# EAGLE design LAN_WIZ_V0.1a (EAGLE 6.4)
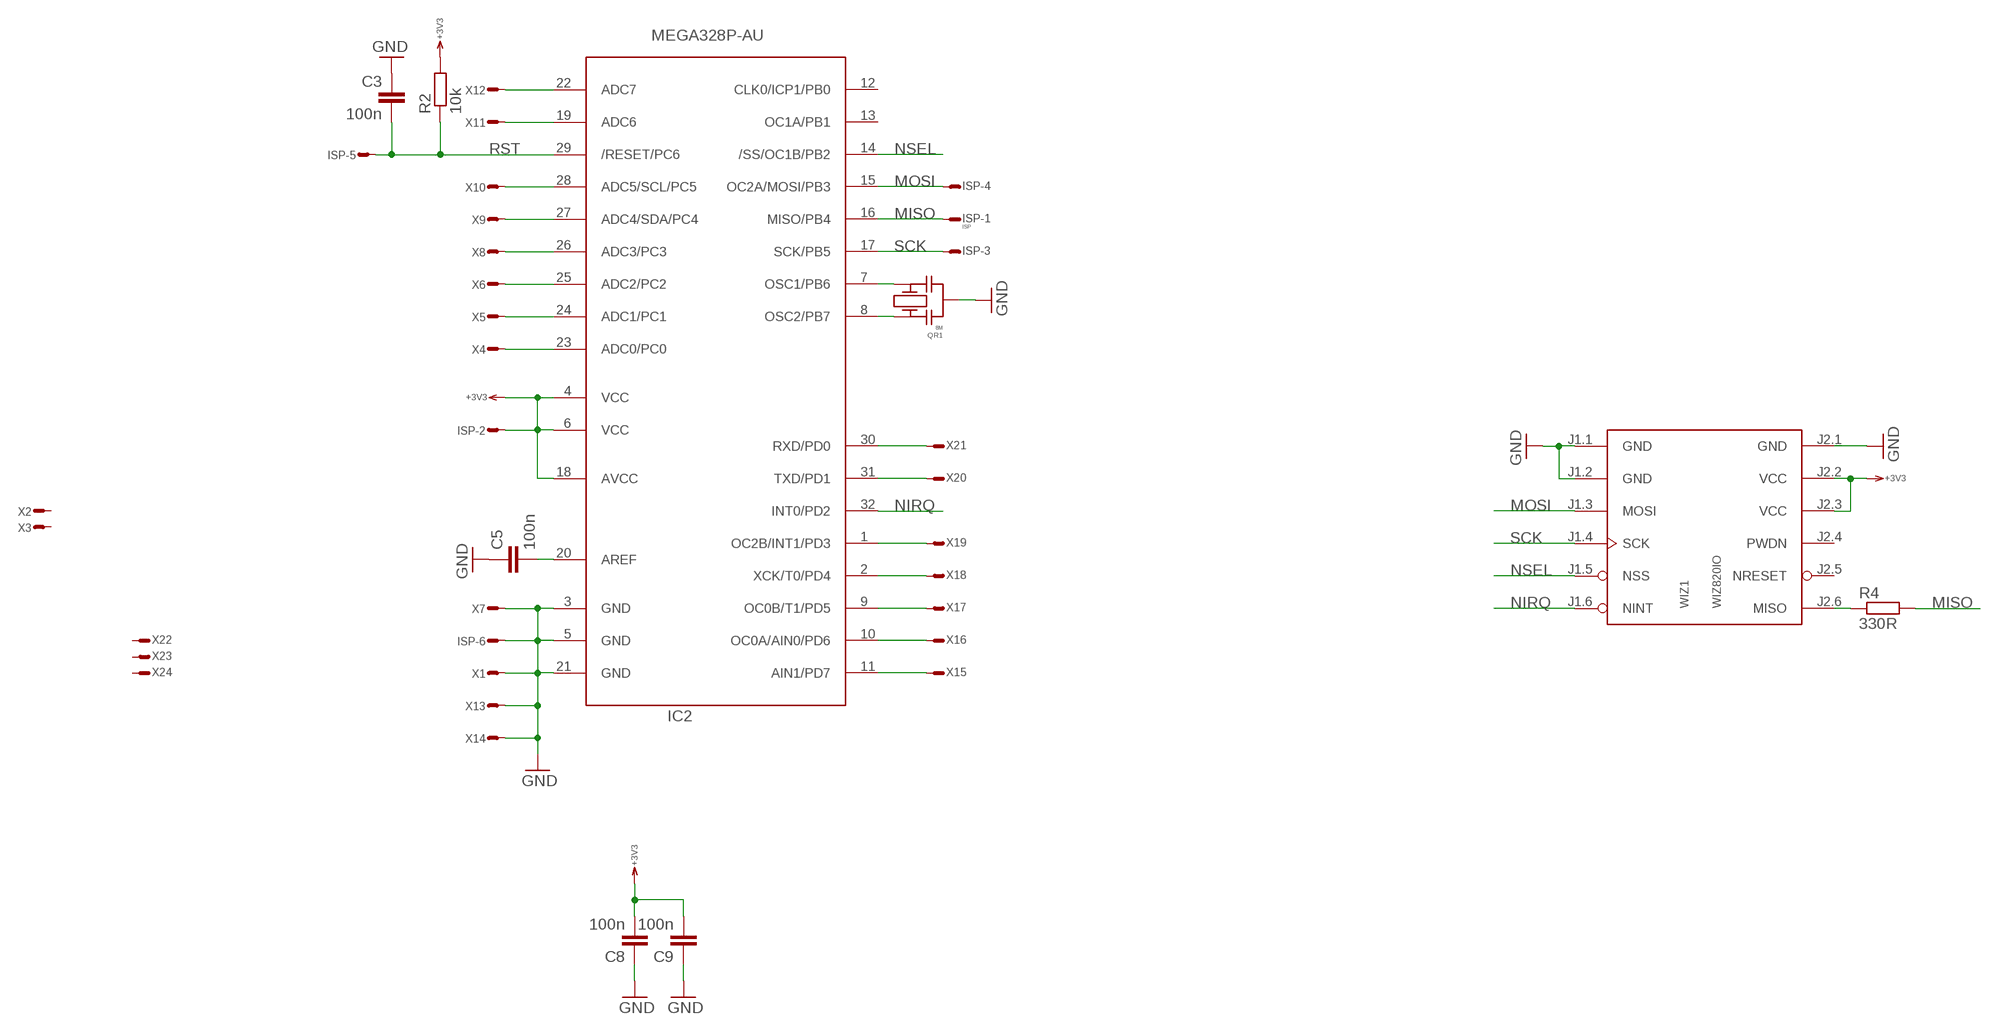
[diagram p0: schematic, sheet 1]

## Parts
C3  100n  C0603  [0603]
C5  100n  C0603  [0603]
C8  100n  C0603  [0603]
C9  100n  C0603  [0603]
IC2  MEGA328P-AU  MEGA168PA  [TQFP32-08]
ISP  ISP  ML6ES  [ML6S]
QR1  8M  QRCR  [CR]
R2  10k  R0603  [0603]
R4  330R  R0603  [0603]
WIZ1  WIZ820IO  [WIZ820IO]
X1  WIREPADT1.6/0.9  [T1.6/0.9]
X2  WIREPADT1.6/0.9  [T1.6/0.9]
X3  WIREPADT1.6/0.9  [T1.6/0.9]
X4  WIREPADT1.6/0.9  [T1.6/0.9]
X5  WIREPADT1.6/0.9  [T1.6/0.9]
X6  WIREPADT1.6/0.9  [T1.6/0.9]
X7  WIREPADT1.6/0.9  [T1.6/0.9]
X8  WIREPADT1.6/0.9  [T1.6/0.9]
X9  WIREPADT1.6/0.9  [T1.6/0.9]
X10  WIREPADT1.6/0.9  [T1.6/0.9]
X11  WIREPADT1.6/0.9  [T1.6/0.9]
X12  WIREPADT1.6/0.9  [T1.6/0.9]
X13  WIREPADT1.6/0.9  [T1.6/0.9]
X14  WIREPADT1.6/0.9  [T1.6/0.9]
X15  WIREPADT1.6/0.9  [T1.6/0.9]
X16  WIREPADT1.6/0.9  [T1.6/0.9]
X17  WIREPADT1.6/0.9  [T1.6/0.9]
X18  WIREPADT1.6/0.9  [T1.6/0.9]
X19  WIREPADT1.6/0.9  [T1.6/0.9]
X20  WIREPADT1.6/0.9  [T1.6/0.9]
X21  WIREPADT1.6/0.9  [T1.6/0.9]
X22  WIREPADT1.6/0.9  [T1.6/0.9]
X23  WIREPADT1.6/0.9  [T1.6/0.9]
X24  WIREPADT1.6/0.9  [T1.6/0.9]

## Nets
+3V3: C8.2 C9.2 IC2.4(VCC) IC2.6(VCC) IC2.18(AVCC) ISP.2 R2.2 WIZ1.J2.2(VCC) WIZ1.J2.3(VCC)
GND: C3.1 C5.1 C8.1 C9.1 IC2.3(GND) IC2.5(GND) IC2.21(GND) ISP.6 QR1.M WIZ1.J1.1(GND) WIZ1.J1.2(GND) WIZ1.J2.1(GND) X1.1(S) X7.1(S) X13.1(S) X14.1(S)
MISO: IC2.16(MISO/PB4) ISP.1 R4.2
MOSI: IC2.15(OC2A/MOSI/PB3) ISP.4 WIZ1.J1.3(MOSI)
N$1: R4.1 WIZ1.J2.6(MISO)
N$2: IC2.23(ADC0/PC0) X4.1(S)
N$3: IC2.24(ADC1/PC1) X5.1(S)
N$4: IC2.25(ADC2/PC2) X6.1(S)
N$5: IC2.26(ADC3/PC3) X8.1(S)
N$6: C5.2 IC2.20(AREF)
N$7: IC2.8(OSC2/PB7) QR1.1
N$8: IC2.7(OSC1/PB6) QR1.2
N$9: IC2.27(ADC4/SDA/PC4) X9.1(S)
N$10: IC2.28(ADC5/SCL/PC5) X10.1(S)
N$12: IC2.19(ADC6) X11.1(S)
N$13: IC2.22(ADC7) X12.1(S)
N$14: IC2.11(AIN1/PD7) X15.1(S)
N$15: IC2.10(OC0A/AIN0/PD6) X16.1(S)
N$16: IC2.9(OC0B/T1/PD5) X17.1(S)
N$17: IC2.2(XCK/T0/PD4) X18.1(S)
N$18: IC2.1(OC2B/INT1/PD3) X19.1(S)
N$19: IC2.31(TXD/PD1) X20.1(S)
N$21: IC2.30(RXD/PD0) X21.1(S)
NIRQ: IC2.32(INT0/PD2) WIZ1.J1.6(NINT)
NSEL: IC2.14(/SS/OC1B/PB2) WIZ1.J1.5(NSS)
RST: C3.2 IC2.29(/RESET/PC6) ISP.5 R2.1
SCK: IC2.17(SCK/PB5) ISP.3 WIZ1.J1.4(SCK)
Unconnected: IC2.12(CLK0/ICP1/PB0) IC2.13(OC1A/PB1) WIZ1.J2.4(PWDN) WIZ1.J2.5(NRESET) X2.1(S) X3.1(S) X22.1(S) X23.1(S) X24.1(S)

## Library data of the parts
C3 C5 C8 C9 = RCL:C: Capacitor SMD
IC2 = atmel:MEGA168P: MCU, 4/8/16k, TQFP32
ISP = Conn:ML6E: HARTING
QR1 = QUARTZ:QR
R2 R4 = RCL:R: Resistor SMD
WIZ1 = Other:WIZ820IO
X1-X24 = Conn:WIREPAD: Wire PAD connect wire on PCB

## Board
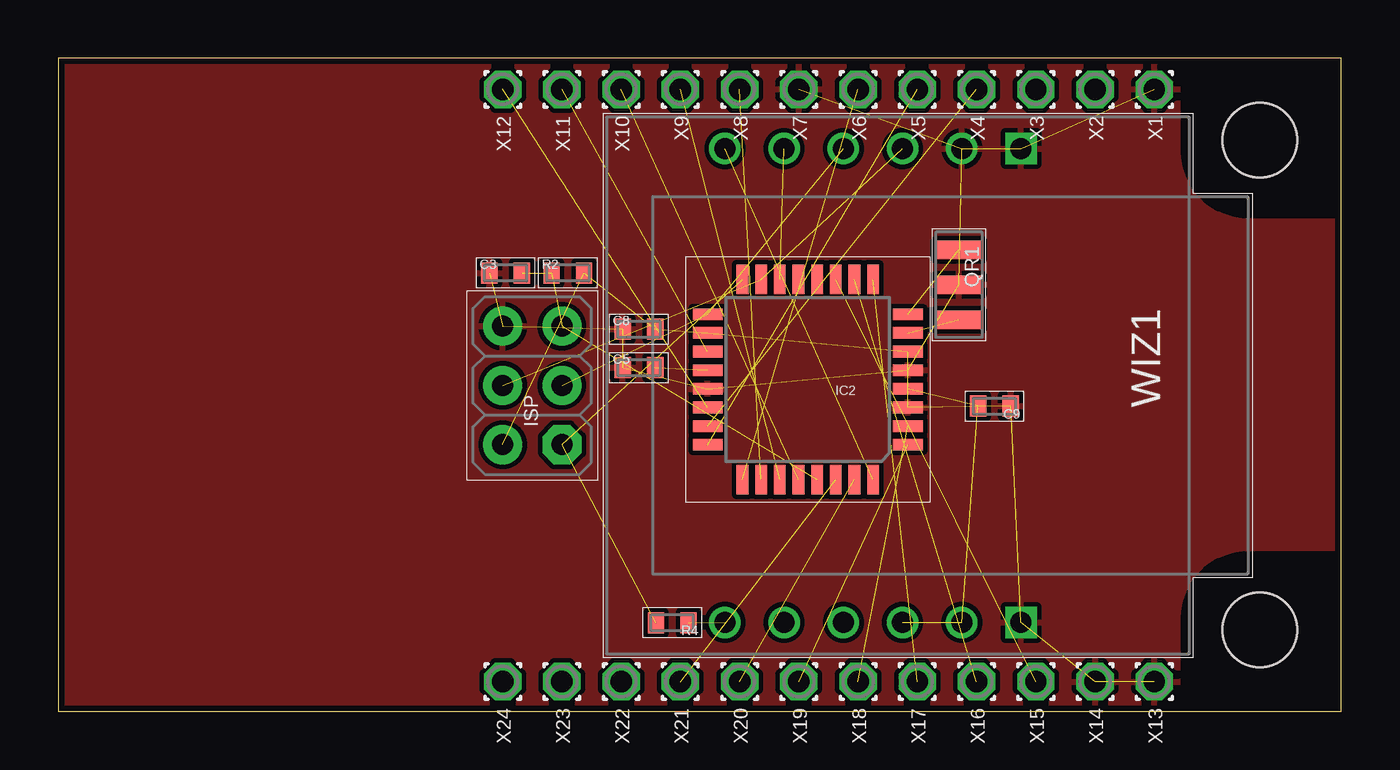
[diagram p1: board, top side]
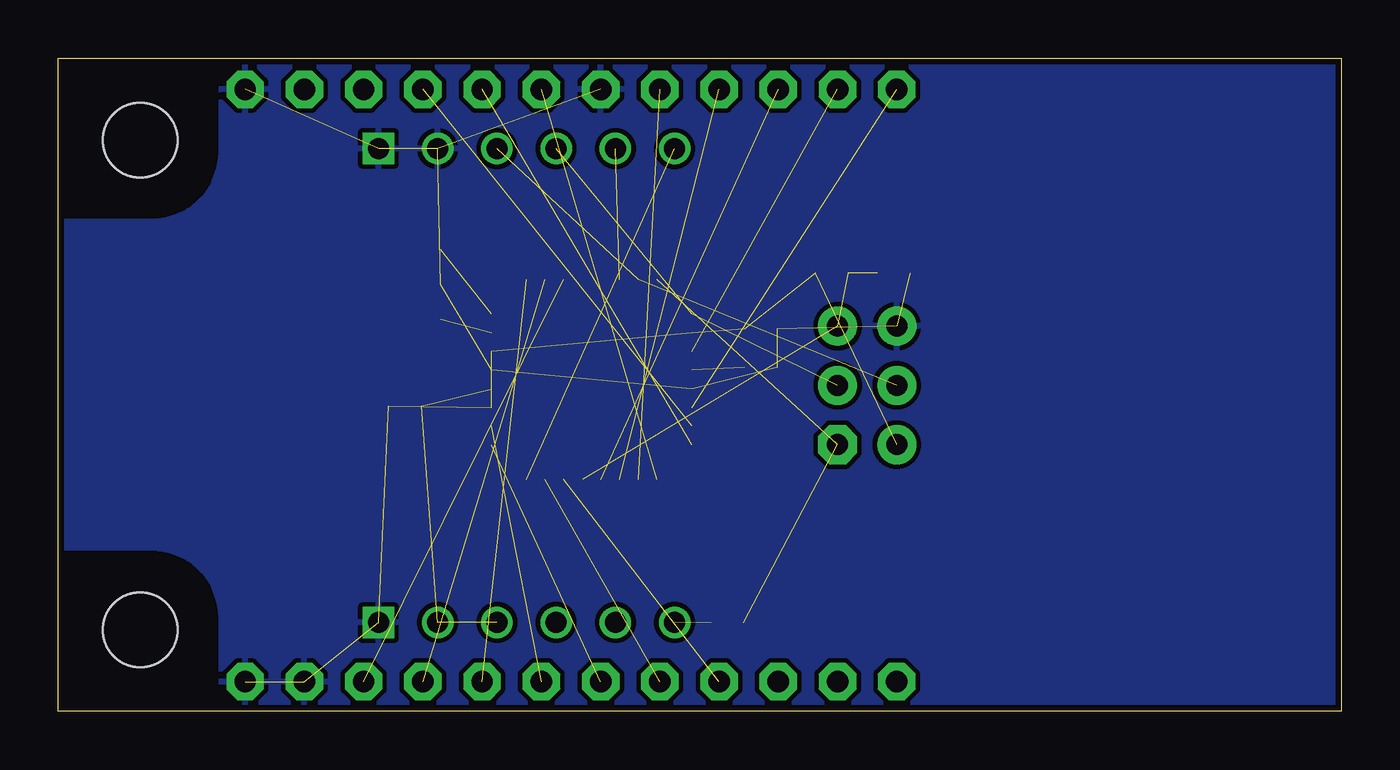
[diagram p2: board, bottom side, seen from below]

Size 55 x 28 mm. Coordinates in mm from the lower left corner, seen from the top.
Outline: 0,0 55,0 55,28 0,28 0,0
Copper layers (1*16): Top 0.035mm / dielectric 1.5mm / Bottom 0.035mm
Design rules "default *": minimum track width 10mil, minimum drill 0.3mm, track to track 8mil, track to pad 8mil, pad to pad 8mil, via to via 8mil, smd to smd 8mil, copper to edge 10mil, drill to drill 8mil, minimum pad ring 5mil, minimum via ring 8mil, stop-mask expansion 4mil, vias tented up to drill 25mil, thermal gap 8mil
Holes 3.2 mm at 51.5,24.5 51.5,3.5

### Footprints (pad centres in the part's own frame; a part is rotated, then mirrored left to right if it is on the bottom)
0603 = smd 0.7 x 0.9: 1 -0.697,0; 2 0.697,0
TQFP32-08 = smd 1.27 x 0.5: 1 -4.293,2.8; 2 -4.293,2; 3 -4.293,1.2; 4 -4.293,0.4; 5 -4.293,-0.4; 6 -4.293,-1.2; 7 -4.293,-2; 8 -4.293,-2.8; 17 4.293,-2.8; 18 4.293,-2; 19 4.293,-1.2; 20 4.293,-0.4; 21 4.293,0.4; 22 4.293,1.2; 23 4.293,2; 24 4.293,2.8 | smd 0.5 x 1.27: 9 -2.8,-4.293; 10 -2,-4.293; 11 -1.2,-4.293; 12 -0.4,-4.293; 13 0.4,-4.293; 14 1.2,-4.293; 15 2,-4.293; 16 2.8,-4.293; 25 2.8,4.293; 26 2,4.293; 27 1.2,4.293; 28 0.4,4.293; 29 -0.4,4.293; 30 -1.2,4.293; 31 -2,4.293; 32 -2.8,4.293
ML6S = drill 0.9 pad 1.676 octagon: 1 -2.54,-1.27 | drill 0.9 pad 1.676: 2 -2.54,1.27; 3 0,-1.27; 4 0,1.27; 5 2.54,-1.27; 6 2.54,1.27
CR = smd 0.8 x 2: 1 -1.5,0; 2 1.5,0; M 0,0
WIZ820IO = drill 0.9 square: J1.1 -10.16,17.78; J2.1 10.16,17.78 | drill 0.9: J1.2 -10.16,15.24; J1.3 -10.16,12.7; J1.4 -10.16,10.16; J1.5 -10.16,7.62; J1.6 -10.16,5.08; J2.2 10.16,15.24; J2.3 10.16,12.7; J2.4 10.16,10.16; J2.5 10.16,7.62; J2.6 10.16,5.08
T1.6/0.9 = drill 0.914 pad 1.6 octagon: 1 0,0

### Placement (x,y rotation side)
C3  19.18,18.8 0 top
C5  24.89,14.73 0 top
C8  24.89,16.38 0 top
C9  40.13,13.08 180 top
IC2  32.13,14.22 180 top
ISP  20.32,13.97 90 top
QR1  38.61,18.29 270 top
R2  21.84,18.8 0 top
R4  26.32,3.79 180 top
WIZ1  23.5,13.97 270 top
X1  46.99,26.67 270 top
X2  44.45,26.67 270 top
X3  41.91,26.67 270 top
X4  39.37,26.67 270 top
X5  36.83,26.67 270 top
X6  34.29,26.67 270 top
X7  31.75,26.67 270 top
X8  29.21,26.67 270 top
X9  26.67,26.67 270 top
X10  24.13,26.67 270 top
X11  21.59,26.67 270 top
X12  19.05,26.67 270 top
X13  46.99,1.27 270 top
X14  44.45,1.27 270 top
X15  41.91,1.27 270 top
X16  39.37,1.27 270 top
X17  36.83,1.27 270 top
X18  34.29,1.27 270 top
X19  31.75,1.27 270 top
X20  29.21,1.27 270 top
X21  26.67,1.27 270 top
X22  24.13,1.27 270 top
X23  21.59,1.27 270 top
X24  19.05,1.27 270 top

### Tracks (layer width: path | path; a pad name or v marks a point on that pad's centre or on a via)
+3V3  (8 unrouted)
GND  (15 unrouted)
  pour Top: 0,0 48,0 48,4 arc-90 51,7 55,7 55,21 51,21 arc-90 48,24 48,28 0,28
  pour Bottom: 0,0 48,0 48,4 arc-90 51,7 55,7 55,21 51,21 arc-90 48,24 48,28 0,28
MISO  (2 unrouted)
MOSI  (2 unrouted)
N$1  (1 unrouted)
N$2  (1 unrouted)
N$3  (1 unrouted)
N$4  (1 unrouted)
N$5  (1 unrouted)
N$6  (1 unrouted)
N$7  (1 unrouted)
N$8  (1 unrouted)
N$9  (1 unrouted)
N$10  (1 unrouted)
N$12  (1 unrouted)
N$13  (1 unrouted)
N$14  (1 unrouted)
N$15  (1 unrouted)
N$16  (1 unrouted)
N$17  (1 unrouted)
N$18  (1 unrouted)
N$19  (1 unrouted)
N$21  (1 unrouted)
NIRQ  (1 unrouted)
NSEL  (1 unrouted)
RST  (3 unrouted)
SCK  (2 unrouted)